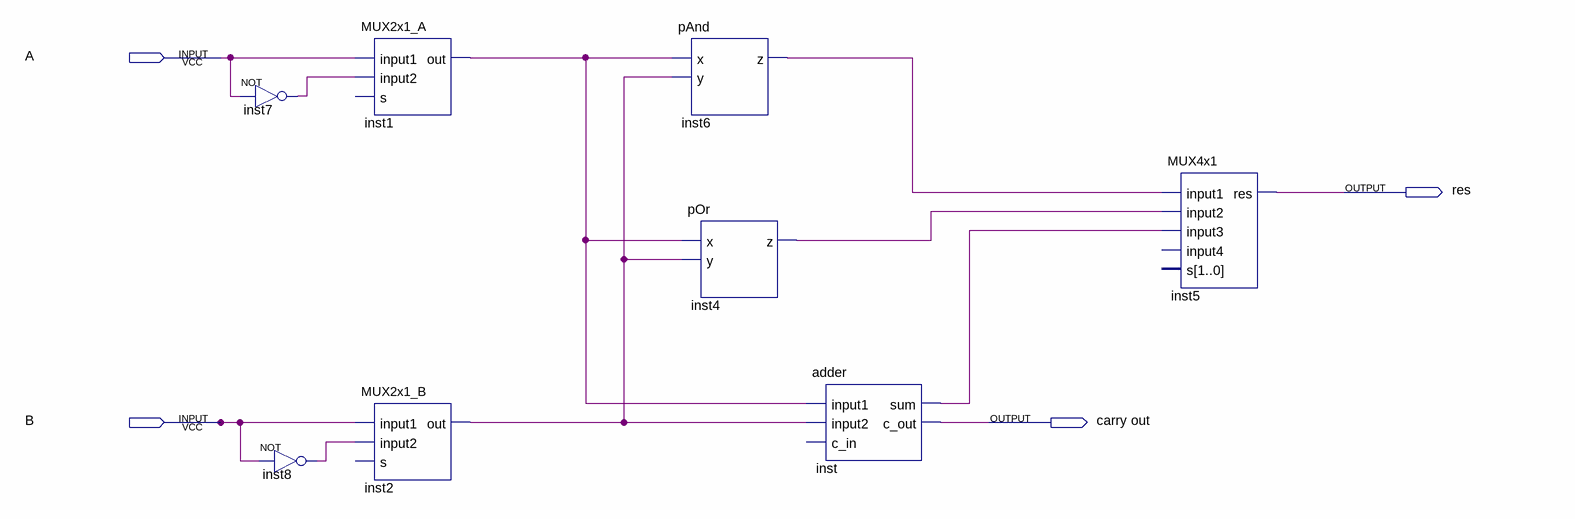
[diagram p0: schematic sheet]
// Quartus schematic Block_DiagramProject.bdf as structural Verilog: 8 symbols, 4 pins
module Block_DiagramProject (
  input  A,
  input  B,
  output res,
  output \carry_out 
);

  wire inst1_out, inst2_out, inst4_z, inst6_z, inst7_out, inst8_out, inst_sum;

  not inst7 (inst7_out, A);
  not inst8 (inst8_out, B);
  MUX2x1_A inst1 (.input1(A), .input2(inst7_out), .out(inst1_out));  // open: s
  MUX2x1_B inst2 (.input1(B), .input2(inst8_out), .out(inst2_out));  // open: s
  pAnd inst6 (.x(inst1_out), .y(inst2_out), .z(inst6_z));
  pOr inst4 (.x(inst1_out), .y(inst2_out), .z(inst4_z));
  adder inst (.input1(inst1_out), .input2(inst2_out), .sum(inst_sum), .c_out(\carry_out ));  // open: c_in
  MUX4x1 inst5 (.input1(inst6_z), .input2(inst4_z), .input3(inst_sum), .res(res));  // open: input4, s
endmodule
